# Altium schematic sheet ADC_RESET.SchDoc: Air724UG 参考设计
size 594 x 419 mm; DESIGNER: Loukanghua; REV: V1.0
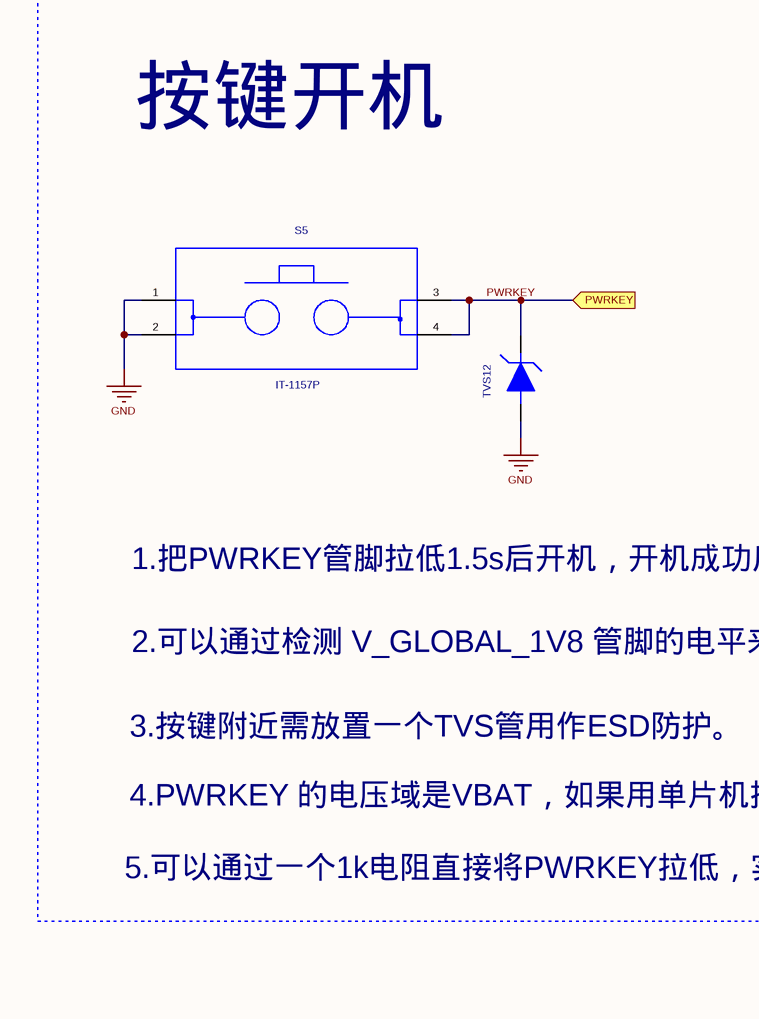
[diagram p0: ADC_RESET.SchDoc, top left]
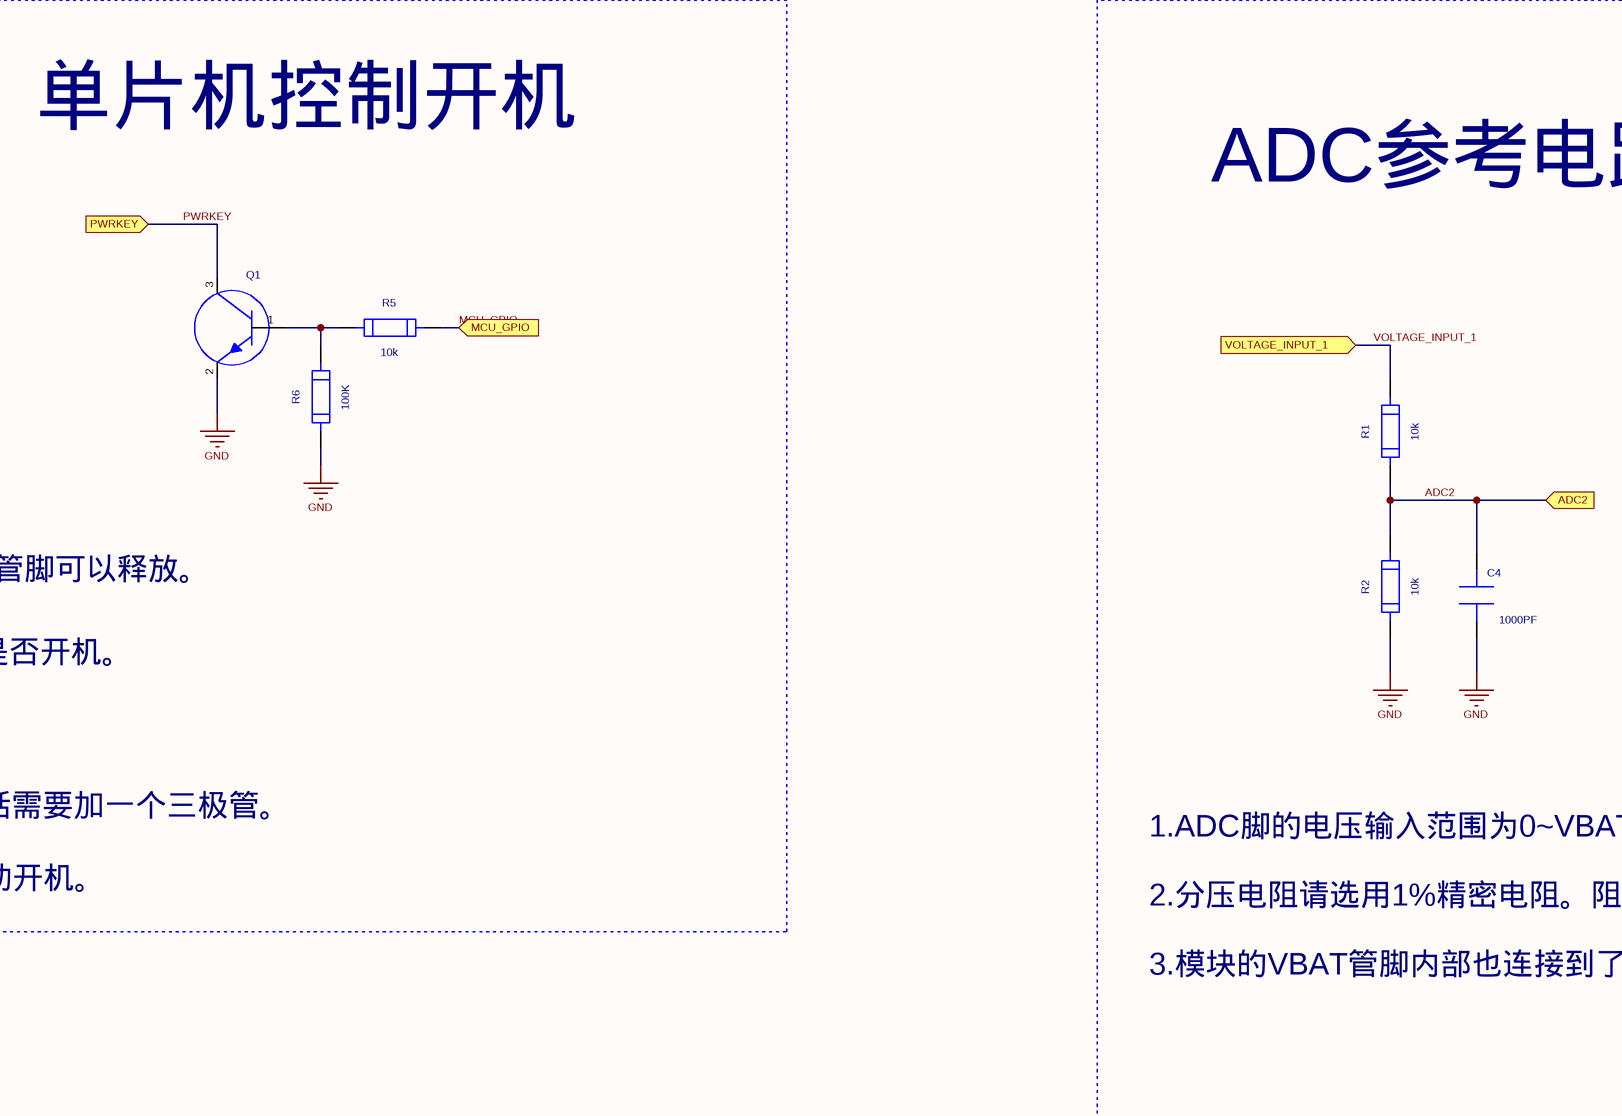
[diagram p1: ADC_RESET.SchDoc, top middle]
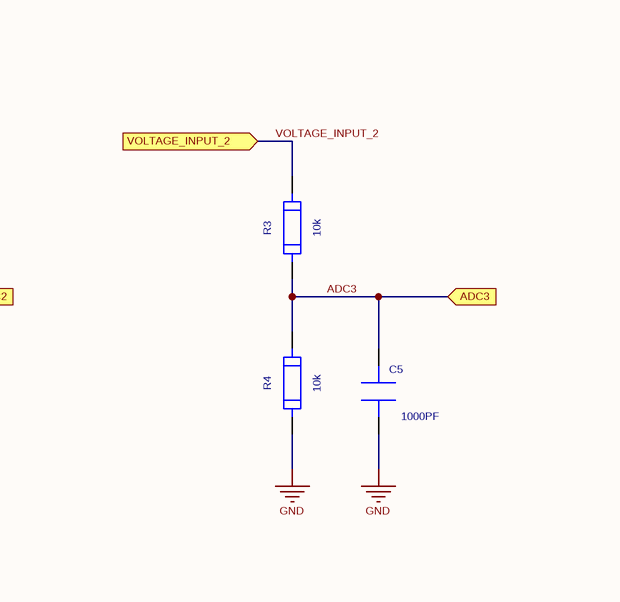
[diagram p2: ADC_RESET.SchDoc, top right]
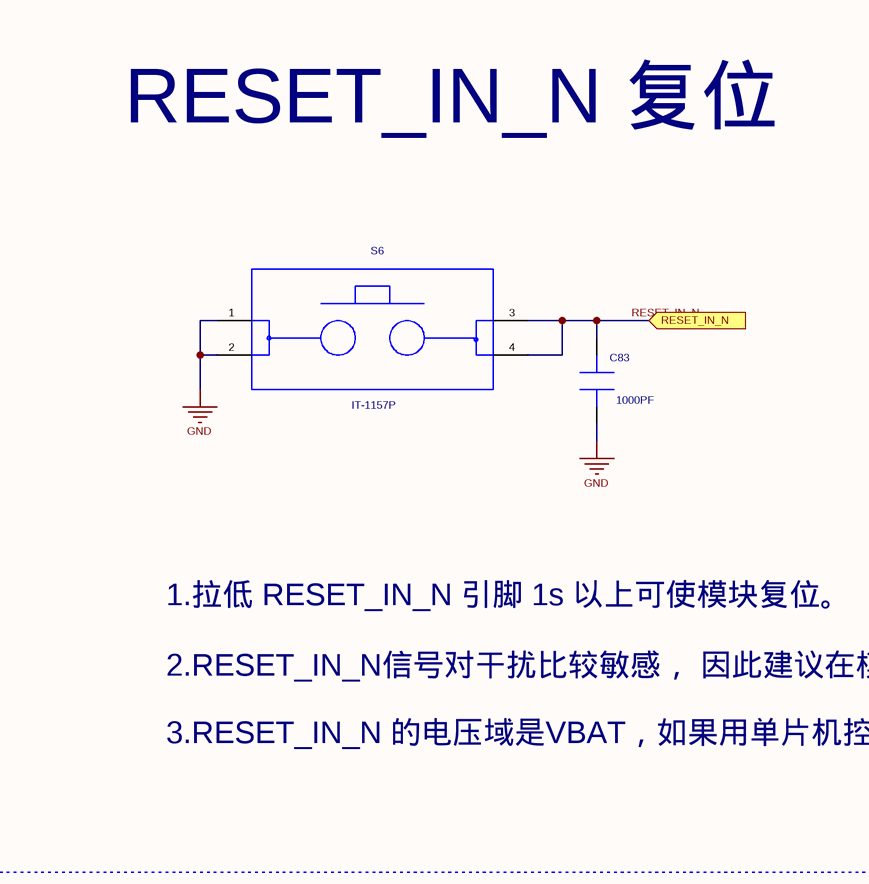
[diagram p3: ADC_RESET.SchDoc, bottom left]
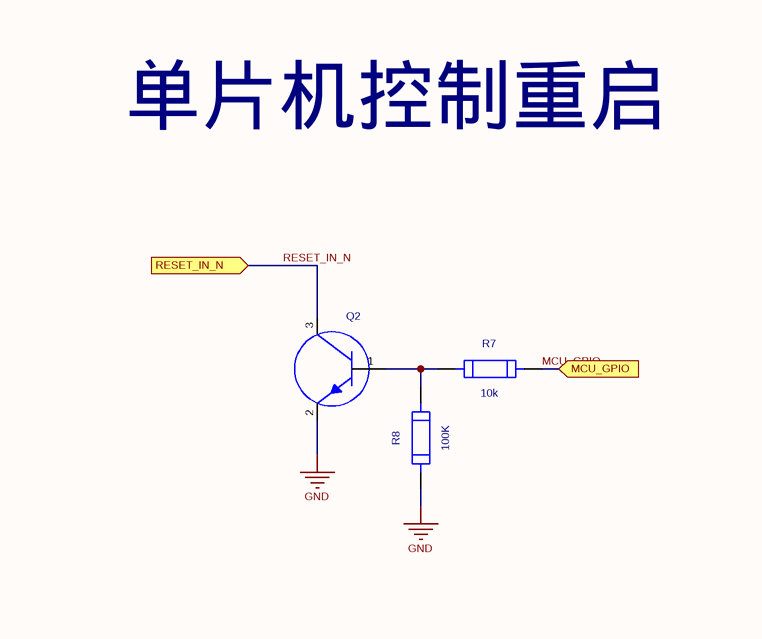
[diagram p4: ADC_RESET.SchDoc, bottom middle]
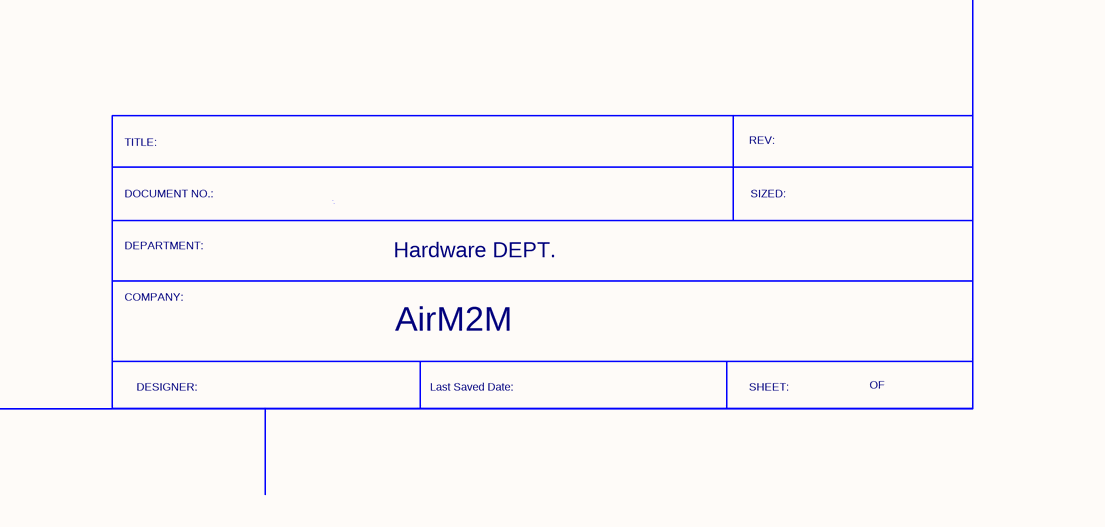
[diagram p5: ADC_RESET.SchDoc, bottom right]

## Parts
C4  value 1000PF  [SC0402]  (hidden comment: CAP-1000PF-0402-X7R)
C5  value 1000PF  [SC0402]  (hidden comment: CAP-1000PF-0402-X7R)
C83  value 1000PF  [SC0402]  (hidden comment: CAP-1000PF-0402-X7R)
Q1  TRIODE-NPN-MMBT3904  [SOT-23(MMBT3904)]  (value not drawn)
Q2  TRIODE-NPN-MMBT3904  [SOT-23(MMBT3904)]  (value not drawn)
R1  value 10k  [SR0402]  (hidden comment: RES-10K-0402)
R2  value 10k  [SR0402]  (hidden comment: RES-10K-0402)
R3  value 10k  [SR0402]  (hidden comment: RES-10K-0402)
R4  value 10k  [SR0402]  (hidden comment: RES-10K-0402)
R5  value 10k  [SR0402]  (hidden comment: RES-10K-0402)
R6  value 100K  [SR0402]  (hidden comment: RES-100K-0402)
R7  value 10k  [SR0402]  (hidden comment: RES-10K-0402)
R8  value 100K  [SR0402]  (hidden comment: RES-100K-0402)
S5  IT-1157P  [IT-1157P]
S6  IT-1157P  [IT-1157P]
TVS12  ESD-TVS-PESDU4581P1H  [DFN1006]  (value not drawn)

## Blocks framed on the sheet
ADC参考电路: C4 C5 R1-R4

## Ports
ADC2 (in), ADC3 (in), MCU_GPIO, PWRKEY, RESET_IN_N, VOLTAGE_INPUT_1, VOLTAGE_INPUT_2

## Nets
GND: C4.1 C5.1 C83.2 Q1.2 Q2.2 R2.1 R4.1 R6.1 R8.1 S5.1 S5.2 S5.5(GND) S6.1 S6.2 S6.5(GND) TVS12.2
ADC2: C4.2 R1.1 R2.2 ; port ADC2
ADC3: C5.2 R3.1 R4.2 ; port ADC3
MCU_GPIO: R5.2 R7.2 ; port MCU_GPIO
PWRKEY: Q1.3 S5.3 S5.4 TVS12.1 ; port PWRKEY
RESET_IN_N: C83.1 Q2.3 S6.3 S6.4 ; port RESET_IN_N
VOLTAGE_INPUT_1: R1.2 ; port VOLTAGE_INPUT_1
VOLTAGE_INPUT_2: R3.2 ; port VOLTAGE_INPUT_2
NetQ1_1: Q1.1 R5.1 R6.2
NetQ2_1: Q2.1 R7.1 R8.2

## Notes on the sheet
- 按键开机
- 单片机控制开机
- 1.把PWRKEY管脚拉低1.5s后开机，开机成功后PWRKEY管脚可以释放。
- 2.可以通过检测 V_GLOBAL_1V8 管脚的电平来判别模块是否开机。
- 3.按键附近需放置一个TVS管用作ESD防护。
- 5.可以通过一个1k电阻直接将PWRKEY拉低，实现上电自动开机。
- 4.PWRKEY 的电压域是VBAT，如果用单片机控制开机的话需要加一个三极管。
- 1.ADC脚的电压输入范围为0~VBAT;分辨率11bits。
- 2.分压电阻请选用1%精密电阻。阻值要高（10K级以上），减少耗流及避免灌电。
- 3.模块的VBAT管脚内部也连接到了ADC，可以读取VBAT管脚的电压。
- RESET_IN_N 复位
- 单片机控制重启
- 1.拉低 RESET_IN_N 引脚 1s 以上可使模块复位。
- 2.RESET_IN_N信号对干扰比较敏感， 因此建议在模块接口板上的走线应尽量的短，且需包地处理。
- 3.RESET_IN_N 的电压域是VBAT，如果用单片机控制重启的话需要加一个三极管。
- TITLE:
- REV:
- DEPARTMENT:
- DOCUMENT NO.:
- Hardware DEPT.
- SIZED:
- COMPANY:
- AirM2M
- DESIGNER:
- Last Saved Date:
- SHEET:
- OF

## Library data of the parts
C4 C5 = CAP-1000PF-0402-X7R: CAP CER X7R;1000PF;+/-10%;50V;0402;0.5mm;ROHS; Manufacture 1 P/N: GRM155R71H102K****;CC0402KRX7R9BB102;0402B102K500CT;C0402X7R102K500N*; Manufacture 1: MURATA;Yageo;Walsin;Eyang; Geometry.Height: 0.55mm; Serial Number: 80214750001; Tolerance: +/-10%; PCB DECAL: SC0402
C83 = CAP-1000PF-0402-X7R: CAP CER X7R;1000PF;+/-10%;50V;0402;0.5mm;ROHS; Manufacture 1: MURATA;Yageo;Walsin;Eyang; Manufacture 1 P/N: GRM155R71H102K****;CC0402KRX7R9BB102;0402B102K500CT;C0402X7R102K500N*; Geometry.Height: 0.55mm; Serial Number: 80214750001; Tolerance: +/-10%; PCB DECAL: SC0402
Q1 Q2 = TRIODE-NPN-MMBT3904: Transistor;NPN;40V;200mA;SOT23;1.1mm;ROHS; Manufacture 1: 长电; Serial Number: 81232000008; Geometry.Height: 1.1mm; Manufacture 1 P/N: MMBT3904; PCB DECAL: SOT-23(MMBT3904)
R1-R4 = RES-10K-0402: RES FILM;10K;+/-5%;1/16W;0402;0.4mm;ROHS; Manufacture 1: YAGEO;Walsin; Manufacture 1 P/N: RC0402JR-0710KL;WR04X103_JTL; Serial Number: 80114640004; Geometry.Height: 0.4mm; Tolerance: +/-5%; PCB DECAL: SR0402
R5 R7 = RES-10K-0402: RES FILM;10K;+/-5%;1/16W;0402;0.4mm;ROHS; Manufacture 1 P/N: RC0402JR-0710KL;WR04X103_JTL; Manufacture 1: YAGEO;Walsin; Serial Number: 80114640004; Geometry.Height: 0.4mm; Tolerance: +/-5%; PCB DECAL: SR0402
R6 R8 = RES-100K-0402: RES FILM;100K;+/-5%;1/16W;0402;0.4mm;ROHS; Manufacture 1: YAGEO;Walsin; Manufacture 1 P/N: RC0402JR-07100KL;WR04X104_JTL;; Geometry.Height: 0.40mm; Serial Number: 80114640005; Tolerance: +/-5%; PCB DECAL: SR0402
S5 S6 = IT-1157P: Geometry.Height: 3.1 mm; PCB DECAL: IT-1157P
TVS12 = ESD-TVS-PESDU4581P1H: TVS；4.5V；双向；400W；DFN1006-2;1*0.6*0.5mm;ROHS; Manufacture 1: 智晶; Serial Number: 920190520185119; Geometry.Height: 0.4mm; Manufacture 1 P/N: PESDU4581P1H; PCB DECAL: DFN1006